# Altium schematic sheet REUN.468349.001_PSU_Board_5B_Interface.SchDoc
size 420 x 297 mm; DocumentNumber: РЕУН.468349.001 Э3 2D; SheetNumber: 6; Format: A3
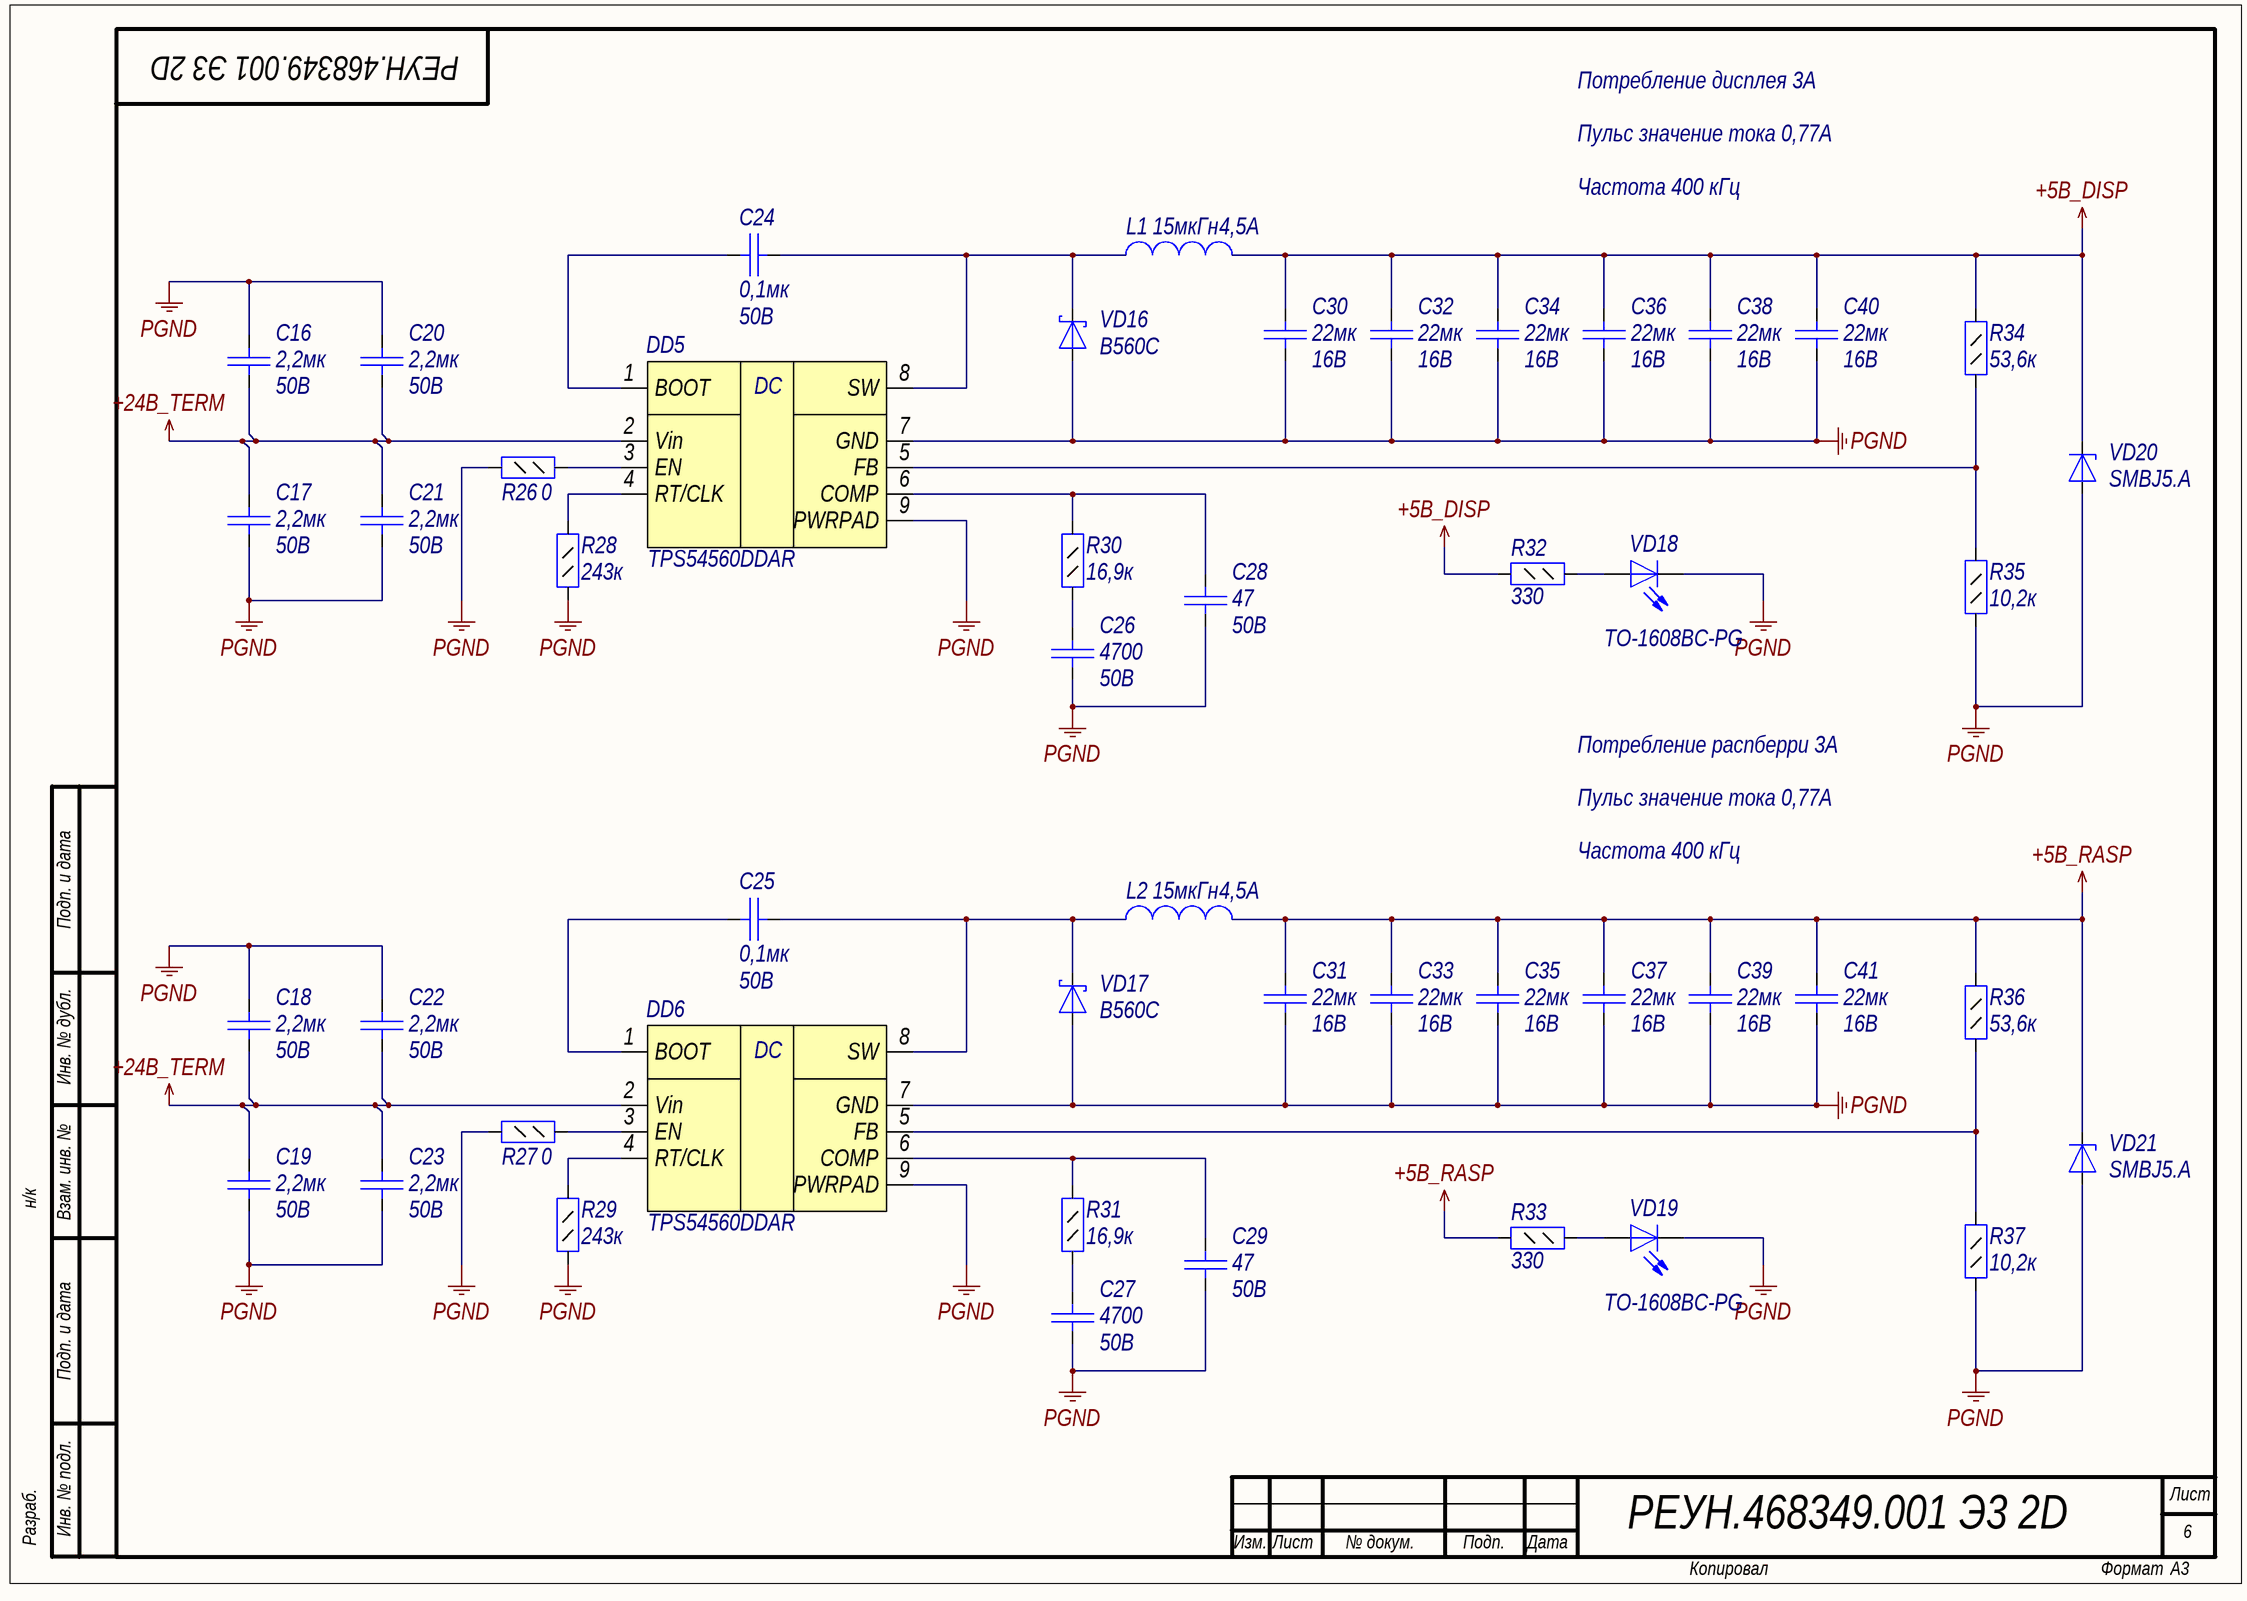
[diagram p0: REUN.468349.001_PSU_Board_5B_Interface.SchDoc]

## Parts
C16  Voltage: 50B  [C1206]  (hidden comment: 2,2мк)
C17  Voltage: 50B  [C1206]  (hidden comment: 2,2мк)
C18  Voltage: 50B  [C1206]  (hidden comment: 2,2мк)
C19  Voltage: 50B  [C1206]  (hidden comment: 2,2мк)
C20  Voltage: 50B  [C1206]  (hidden comment: 2,2мк)
C21  Voltage: 50B  [C1206]  (hidden comment: 2,2мк)
C22  Voltage: 50B  [C1206]  (hidden comment: 2,2мк)
C23  Voltage: 50B  [C1206]  (hidden comment: 2,2мк)
C24  Voltage: 50B  [C0805]  (hidden comment: 0,1мк)
C25  Voltage: 50B  [C0805]  (hidden comment: 0,1мк)
C26  Voltage: 50B  [C0805]  (hidden comment: 4700)
C27  Voltage: 50B  [C0805]  (hidden comment: 4700)
C28  Voltage: 50B  [C0805]  (hidden comment: 47)
C29  Voltage: 50B  [C0805]  (hidden comment: 47)
C30  Voltage: 16B  [C1210]  (hidden comment: 22мк)
C31  Voltage: 16B  [C1210]  (hidden comment: 22мк)
C32  Voltage: 16B  [C1210]  (hidden comment: 22мк)
C33  Voltage: 16B  [C1210]  (hidden comment: 22мк)
C34  Voltage: 16B  [C1210]  (hidden comment: 22мк)
C35  Voltage: 16B  [C1210]  (hidden comment: 22мк)
C36  Voltage: 16B  [C1210]  (hidden comment: 22мк)
C37  Voltage: 16B  [C1210]  (hidden comment: 22мк)
C38  Voltage: 16B  [C1210]  (hidden comment: 22мк)
C39  Voltage: 16B  [C1210]  (hidden comment: 22мк)
C40  Voltage: 16B  [C1210]  (hidden comment: 22мк)
C41  Voltage: 16B  [C1210]  (hidden comment: 22мк)
DD5  TPS54560DDAR  [SO Powerpad8]
DD6  TPS54560DDAR  [SO Powerpad8]
L1  value 15мкГн  Rated Current: 4,5A  [IND_12.5x12.5]  (hidden comment: Inductor)
L2  value 15мкГн  Rated Current: 4,5A  [IND_12.5x12.5]  (hidden comment: Inductor)
R26  value 0  [R0805]  (hidden comment: Resistor_0,125Вт)
R27  value 0  [R0805]  (hidden comment: Resistor_0,125Вт)
R28  value 243к  [R0805]  (hidden comment: Resistor_0,125Вт)
R29  value 243к  [R0805]  (hidden comment: Resistor_0,125Вт)
R30  value 16,9к  [R0805]  (hidden comment: Resistor_0,125Вт)
R31  value 16,9к  [R0805]  (hidden comment: Resistor_0,125Вт)
R32  value 330  [R0805]  (hidden comment: Resistor_0,125Вт)
R33  value 330  [R0805]  (hidden comment: Resistor_0,125Вт)
R34  value 53,6к  [R0805]  (hidden comment: Resistor_0,125Вт)
R35  value 10,2к  [R0805]  (hidden comment: Resistor_0,125Вт)
R36  value 53,6к  [R0805]  (hidden comment: Resistor_0,125Вт)
R37  value 10,2к  [R0805]  (hidden comment: Resistor_0,125Вт)
VD16  B560C  [SMC]
VD17  B560C  [SMC]
VD18  TO-1608BC-PG  [L_0603_GREEN]
VD19  TO-1608BC-PG  [L_0603_GREEN]
VD20  SMBJ5.A  [SMB]
VD21  SMBJ5.A  [SMB]

## Nets
+5B_DISP: C30.2 C32.2 C34.2 C36.2 C38.2 C40.2 L1.2 R32.2 R34.2 VD20.1(K)
+5B_RASP: C31.2 C33.2 C35.2 C37.2 C39.2 C41.2 L2.2 R33.2 R36.2 VD21.1(K)
+24B_TERM: C16.1 C17.2 C18.1 C19.2 C20.1 C21.2 C22.1 C23.2 DD5.2(Vin) DD6.2(Vin)
PGND: C16.2 C17.1 C18.2 C19.1 C20.2 C21.1 C22.2 C23.1 C26.1 C27.1 C28.1 C29.1 C30.1 C31.1 C32.1 C33.1 C34.1 C35.1 C36.1 C37.1 C38.1 C39.1 C40.1 C41.1 DD5.7(GND) DD5.9(PWRPAD) DD6.7(GND) DD6.9(PWRPAD) R26.2 R27.2 R28.1 R29.1 R35.1 R37.1 VD16.2(A) VD17.2(A) VD18.1(K) VD19.1(K) VD20.2(A) VD21.2(A)
NetC24_1: C24.1 DD5.8(SW) L1.1 VD16.1(K)
NetC24_2: C24.2 DD5.1(BOOT)
NetC25_1: C25.1 DD6.8(SW) L2.1 VD17.1(K)
NetC25_2: C25.2 DD6.1(BOOT)
NetC26_2: C26.2 R30.1
NetC27_2: C27.2 R31.1
NetC28_2: C28.2 DD5.6(COMP) R30.2
NetC29_2: C29.2 DD6.6(COMP) R31.2
NetDD5_3: DD5.3(EN) R26.1
NetDD5_4: DD5.4(RT/CLK) R28.2
NetDD5_5: DD5.5(FB) R34.1 R35.2
NetDD6_3: DD6.3(EN) R27.1
NetDD6_4: DD6.4(RT/CLK) R29.2
NetDD6_5: DD6.5(FB) R36.1 R37.2
NetR32_1: R32.1 VD18.2(A)
NetR33_1: R33.1 VD19.2(A)

## Notes on the sheet
- Потребление дисплея 3А
- Пульс значение тока 0,77А
- Частота 400 кГц
- Потребление распберри 3А
- Подп. и дата
- Инв. № дубл.
- н/к
- Взам. инв. №
- Разраб.
- Инв. № подл.
- Лист
- Изм.
- № докум.
- Подп.
- Дата
- Копировал
- Формат
- (in symbol pwr177) DC

## Library data of the parts
C16-C23 = cap351: Конденсатор; Part Name: MLCC; Manufacture: Samsung; Part Number: CL31B225KBHNNNE; id: cap351; TKE: X7R; tga: 0.10%; Value: 2,2мк
C24 C25 = cap141: Конденсатор; Part Name: Ceramic; Manufacture: Murata; Part Number: GRM21BR71H104KA01K; id: cap141; TKE: X7R; Value: 0,1мк
C26 C27 = cap354: Конденсатор; Part Name: Ceramic; Manufacture: Yageo; Part Number: CC0805KRX7R9BB472; id: cap354; TKE: X7R; tga: 0.10%; Value: 4700
C28 C29 = cap353: Конденсатор; Part Name: Ceramic; Manufacture: Yageo; Part Number: CC0805JRNPO9BN470; id: cap353; TKE: NP0; tga: 0.05%; Value: 47
C30-C41 = cap352: Конденсатор; Part Name: MLCC; Manufacture: Samsung; Part Number: CL32B226KOJNNNE; id: cap352; TKE: X7R; tga: 0.10%; Value: 22мк
DD5 DD6 = pwr177: 5-A, Wide Input Range, Step-Down Converter; Part Name: Step Down DC-DC Converter with Eco-mode; Manufacturer: Texas Instruments; id: pwr177; Input Voltage: 4,5-60В; Output Voltage: 0,8B-58,8B; Current: 5A; Frequency: 100 kHz-25 MHz; Type: Impulse; Part Number: TPS54560DDAR
L1 L2 = ind78: EMI Suppression Filter; Part Name: SMD Power Inductors; Part Number: B82477G4153M000; Manufacture: Epcos; id: ind78; Saturation Current: 5,25A; Resistance: 0,027Ohm
R26 R27 = res25: Резистор; Manufacture: Yageo; Part Number: RC0805FR-070RL; id: res49; Accuracy: 0.01; Part Name: Resistor; Power: 0,125Вт
R28 R29 = res1226: Резистор; Manufacture: Yageo; Part Number: RC0805FR-07243KL; Accuracy: 0.01; id: res1226; Part Name: Resistor; Power: 0,125Вт
R30 R31 = res1186: Резистор; Manufacture: Yageo; Part Number: RC0805FR-0716K9L; Accuracy: 0.01; id: res1186; Part Name: Resistor; Power: 0,125Вт
R32 R33 = res62: Резистор; Manufacture: Yageo; Part Number: RC0805FR-07330RL; id: res62; Accuracy: 0.01; Part Name: Resistor; Power: 0,125Вт
R34 R36 = res1234: Резистор; Manufacture: Yageo; Part Number: RC0805FR-0753K6L; Accuracy: 0.01; id: res1234; Part Name: Resistor; Power: 0,125Вт
R35 R37 = res1230: Резистор; Manufacture: Yageo; Part Number: RC0805FR-0710K2L; Accuracy: 0.01; id: res1230; Part Name: Resistor; Power: 0,125Вт
VD16 VD17 = diode32: Диод Шоттки; Part Name: SCHOTTKY BARRIER RECTIFIER; Manufacture: Diodes Incorporated; Max Reverse Voltage: 60B; Forward Voltage: 0,7B; Forward Current: 5A; Reverse Current: 20mA; Capacitance: 300pF; Number: 1; id: diode32; Temp MAX: +150; Temp MIN: -55; Part Number: B560C
VD18 VD19 = diode43: Светодиод; Part Name: LED green 0603; Manufacture: OASISTEK; id: diode43; Part Number: TO-1608BC-PG
VD20 VD21 = SMBJ5.A: Cтабилитрон (лавинный выпрямительный диод) односторонний; Part Name: TVS diode Unidirectional; Manufacture: ST Microelectronics; id: tvs68; Leakage Current: 20uA; Stand-off Voltage: 5B; Breakdown Voltage: 6,74B; Clamping voltage: 9,2B; Dynamic resistance: 0,031Ohm; Peak Pulse Power: 600W; Number of diodes: 1; Part Number: SMBJ5.A